# Altium schematic sheet RP2350_CWHusky.SchDoc: CWHusky Edge Connector
size Letter; Organization: NewAE Technology Inc.; Address1: 1083 Queen St., Suite 196; Address2: Halifax; Address3: NS; Address4: Canada B3H 0B2; DocumentNumber: .; Revision: .; SheetNumber: 2; SheetTotal: 4; SheetApproved: NO
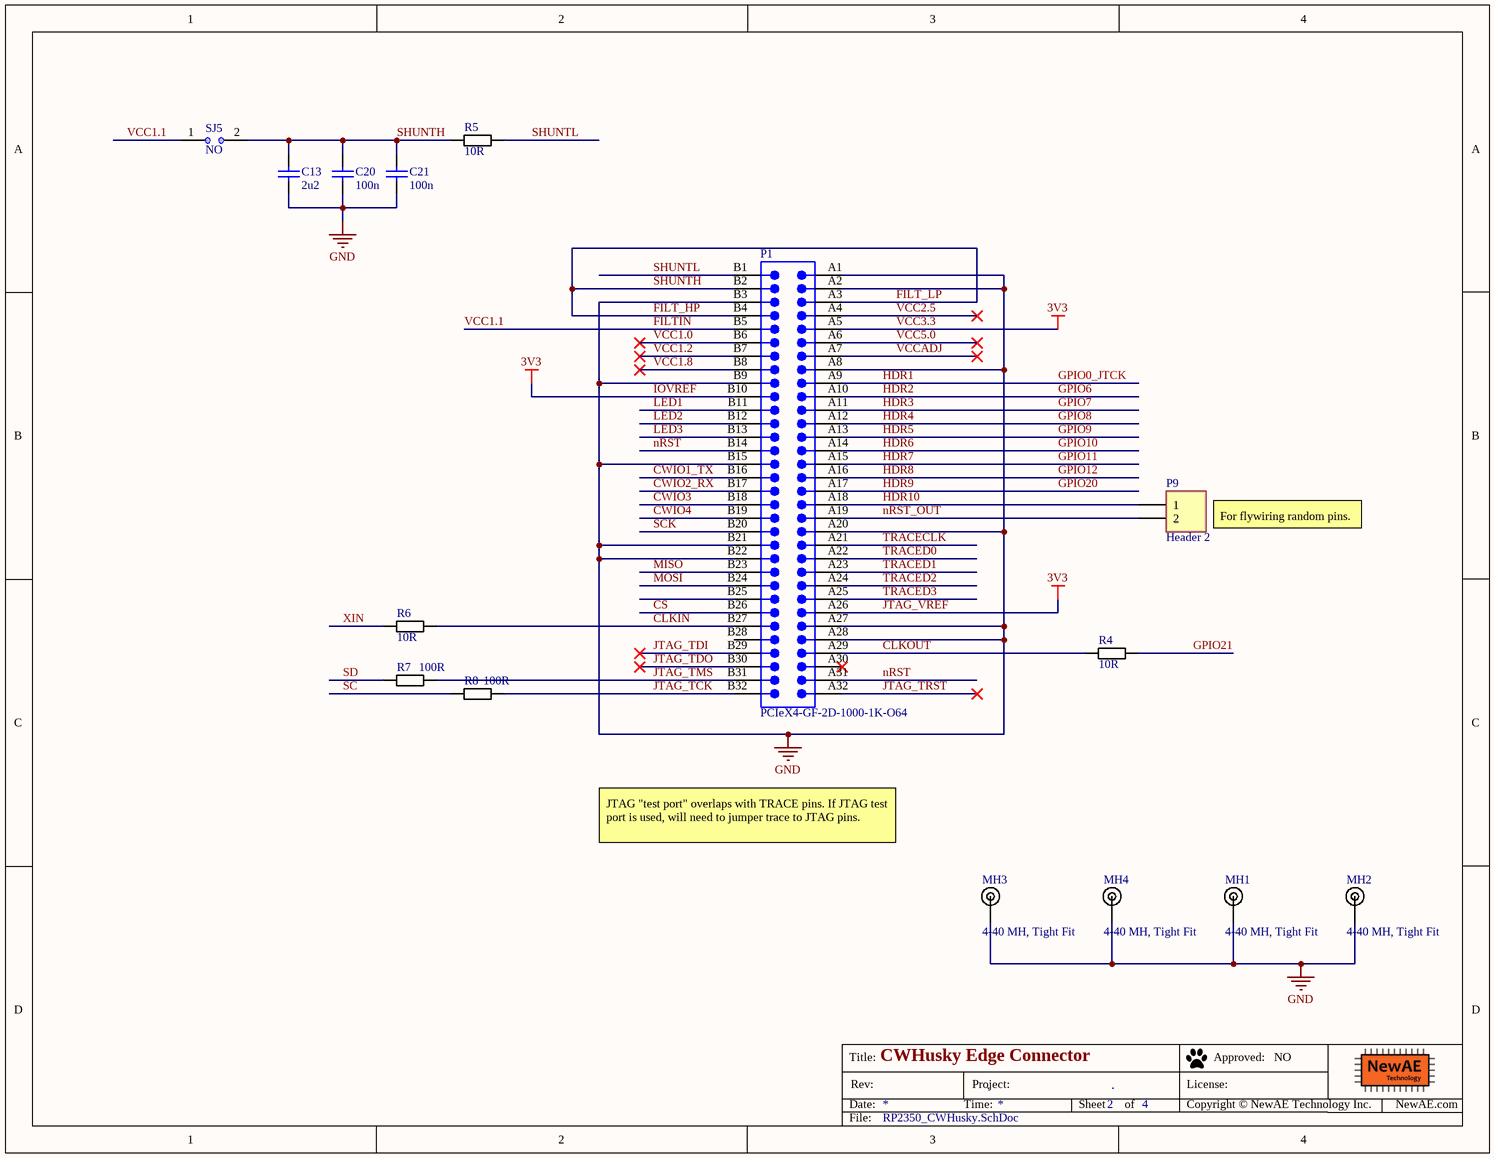
[diagram p0: RP2350_CWHusky.SchDoc]

## Parts
C13  2u2  [CAPC0603_M]
C20  100n  [CAPC0603_M]
C21  100n  [CAPC0603_M]
MH1  4-40 MH, Tight Fit  [MOUNT_#4_TIGHT]
MH2  4-40 MH, Tight Fit  [MOUNT_#4_TIGHT]
MH3  4-40 MH, Tight Fit  [MOUNT_#4_TIGHT]
MH4  4-40 MH, Tight Fit  [MOUNT_#4_TIGHT]
P1  PCIeX4-GF-2D-1000-1K-O64  [PCIeX4-GF-2D-1000-1K-O64]  (no BOM)
P9  Header 2  [HDR1X2]
R4  10R  [RESC1608X55N]
R5  10R  [RESC1608X55N]
R6  10R  [RESC1608X55N]
R7  100R  [RESC1608X55N]
R8  100R  [RESC1608X55N]
SJ5  NO  [SJ_2S_NO]  (no BOM)

## Nets
GND: C13.2 C20.2 C21.2 MH1.1 MH2.1 MH3.1 MH4.1 P1.A1 P1.A2 P1.A8 P1.A20 P1.A27 P1.A28 P1.B3 P1.B9 P1.B15 P1.B21 P1.B22
IOVREF: P1.A5 P1.A26 P1.B10  [also labelled 3V3, JTAG_VREF, VCC3.3]
CLKIN: P1.B27 R6.2
CLKOUT: P1.A29 R4.1
CS: P1.B26
CWIO1_TX: P1.B16
CWIO2_RX: P1.B17
CWIO3: P1.B18
CWIO4: P1.B19
FILT_HP: C13.1 C20.1 C21.1 P1.A3 P1.B2 P1.B4 R5.1 SJ5.2  [also labelled FILT_LP, SHUNTH]
FILTIN: P1.B5 SJ5.1  [also labelled VCC1.1]
GPIO0_JTCK: P1.A9  [also labelled HDR1]
GPIO6: P1.A10  [also labelled HDR2]
GPIO7: P1.A11  [also labelled HDR3]
GPIO8: P1.A12  [also labelled HDR4]
GPIO9: P1.A13  [also labelled HDR5]
GPIO10: P1.A14  [also labelled HDR6]
GPIO11: P1.A15  [also labelled HDR7]
GPIO12: P1.A16  [also labelled HDR8]
GPIO20: P1.A17  [also labelled HDR9]
GPIO21: R4.2
HDR10: P1.A18 P9.1
JTAG_TCK: P1.B32 R8.2
JTAG_TDI: P1.B29
JTAG_TDO: P1.B30
JTAG_TMS: P1.B31 R7.2
JTAG_TRST: P1.A32
LED1: P1.B11
LED2: P1.B12
LED3: P1.B13
MISO: P1.B23
MOSI: P1.B24
nRST: P1.A31 P1.B14
nRST_OUT: P1.A19 P9.2
SC: R8.1
SCK: P1.B20
SD: R7.1
SHUNTL: P1.B1 R5.2
TRACECLK: P1.A21
TRACED0: P1.A22
TRACED1: P1.A23
TRACED2: P1.A24
TRACED3: P1.A25
VCC1.0: P1.B6
VCC1.2: P1.B7
VCC1.8: P1.B8
VCC2.5: P1.A4
VCC5.0: P1.A6
VCCADJ: P1.A7
XIN: R6.1

Not connected (* = marked no-connect by the designer): P1 A30* B25 B28

## Notes on the sheet
- (near P9) For flywiring random pins.
- JTAG "test port" overlaps with TRACE pins. If JTAG test port is used, will need to jumper trace to JTAG pins.
- Title:
- Date:
- Rev:
- Time:
- Project:
- Sheet
- of
- License:
- Copyright © NewAE Technology Inc.
- Approved:
- NewAE.com
- File:

## Library data of the parts
C13 = CCHIP-2u2-0603: 2u2, 0603; Manufacture 1: Samsung; Manufacture Part Number 1: CL10B225KP8NNNC; Component Group: Capacitor; Case-EIA: 0603; Case-Metric: 1608; Rated Voltage: 10VDC; Part Number: CCHIP-2u2-0603; Footprint: 0603; Pin Count: 2; Supplier 1: Digi-Key; Supplier Part Number 1: 1276-1134-1-ND; Value: 2u2; Mounting Technology: SMT; Component Kind: Standard; Component Type: Standard
C20 C21 = CCHIP-100n-0603: 100n, 0603; Manufacture 1: Kemet; Manufacture Part Number 1: C0603C104K5RACTU; Component Group: Capacitor; Case-EIA: 0603; Case-Metric: 1608; Rated Voltage: 50VDC; Part Number: CCHIP-100n-0603; Footprint: 0603; Pin Count: 2; Supplier 1: Digi-Key; Supplier Part Number 1: 399-5089-2-ND; Value: 100n; Mounting Technology: SMT; Component Kind: Standard; Component Type: Standard
MH1-MH4 = MOUNT_#4_TIGHT: Machine screw 4-40 Mounting Hole; Component Group: Mechanical; PP Material Stack: 0; Part Number: MOUNT_#4_TIGHT; Pin Count: 1; Component Kind: Mechanical; Component Type: Mechanical; PP Rotation: 0
P1 = CMP-0001-00031-2: Golden finger, PCIeX4, Dual, Opposite, Pitch 1mm, 64-Position; Mating Connector: Molex-87715-9106; Publisher: Altium; ClassName: Edge Connector; Datasheet Version: rev2.0, Apr-2007; Package Reference: PCIeX4-GF-2D-1000-1K-O64
P9 = Header 2: Header, 2-Pin; LatestRevisionDate: 17-Jul-2002; LatestRevisionNote: Re-released for DXP Platform.; Publisher: Altium Limited
R4-R6 = RCHIP-10R-0603: 10R res, 0603, 1%, 1/10W; Manufacture 1: Yageo; Manufacture Part Number 1: RC0603FR-0710RL; Component Group: Resistor; Case-EIA: 0603; Case-Metric: 1608; Rated Power: 0.1W; Rated Voltage: 75VDC; Part Number: RCHIP-10R-0603; Footprint: 0603; Pin Count: 2; Supplier 1: Digi-Key; Supplier Part Number 1: 311-10.0HRCT-ND; Value: 10R; Tolerance: 1%; Mounting Technology: SMT; Temperature Range: -55C to 155C; Component Kind: Standard; Component Type: Standard
R7 R8 = RCHIP-100R-0603: 100R res, 0603, 1%, 1/10W; Manufacture 1: Yageo; Manufacture Part Number 1: RC0603FR-07100RL; Component Group: Resistor; Case-EIA: 0603; Case-Metric: 1608; Rated Power: 0.1W; Rated Voltage: 75VDC; Part Number: RCHIP-100R-0603; Footprint: 0603; Pin Count: 2; Supplier 1: Digi-Key; Supplier Part Number 1: 311-100HRCT-ND; Value: 100R; Tolerance: 1%; Mounting Technology: SMT; Temperature Range: -55C to 155C; Component Kind: Standard; Component Type: Standard
SJ5 = SJ_2S_NO: Solder Jumper, NO; Component Group: PCB Feature; Part Number: SJ_2S_NO; Pin Count: 2; Mounting Technology: COPPER; Component Type: Standard (No BOM)